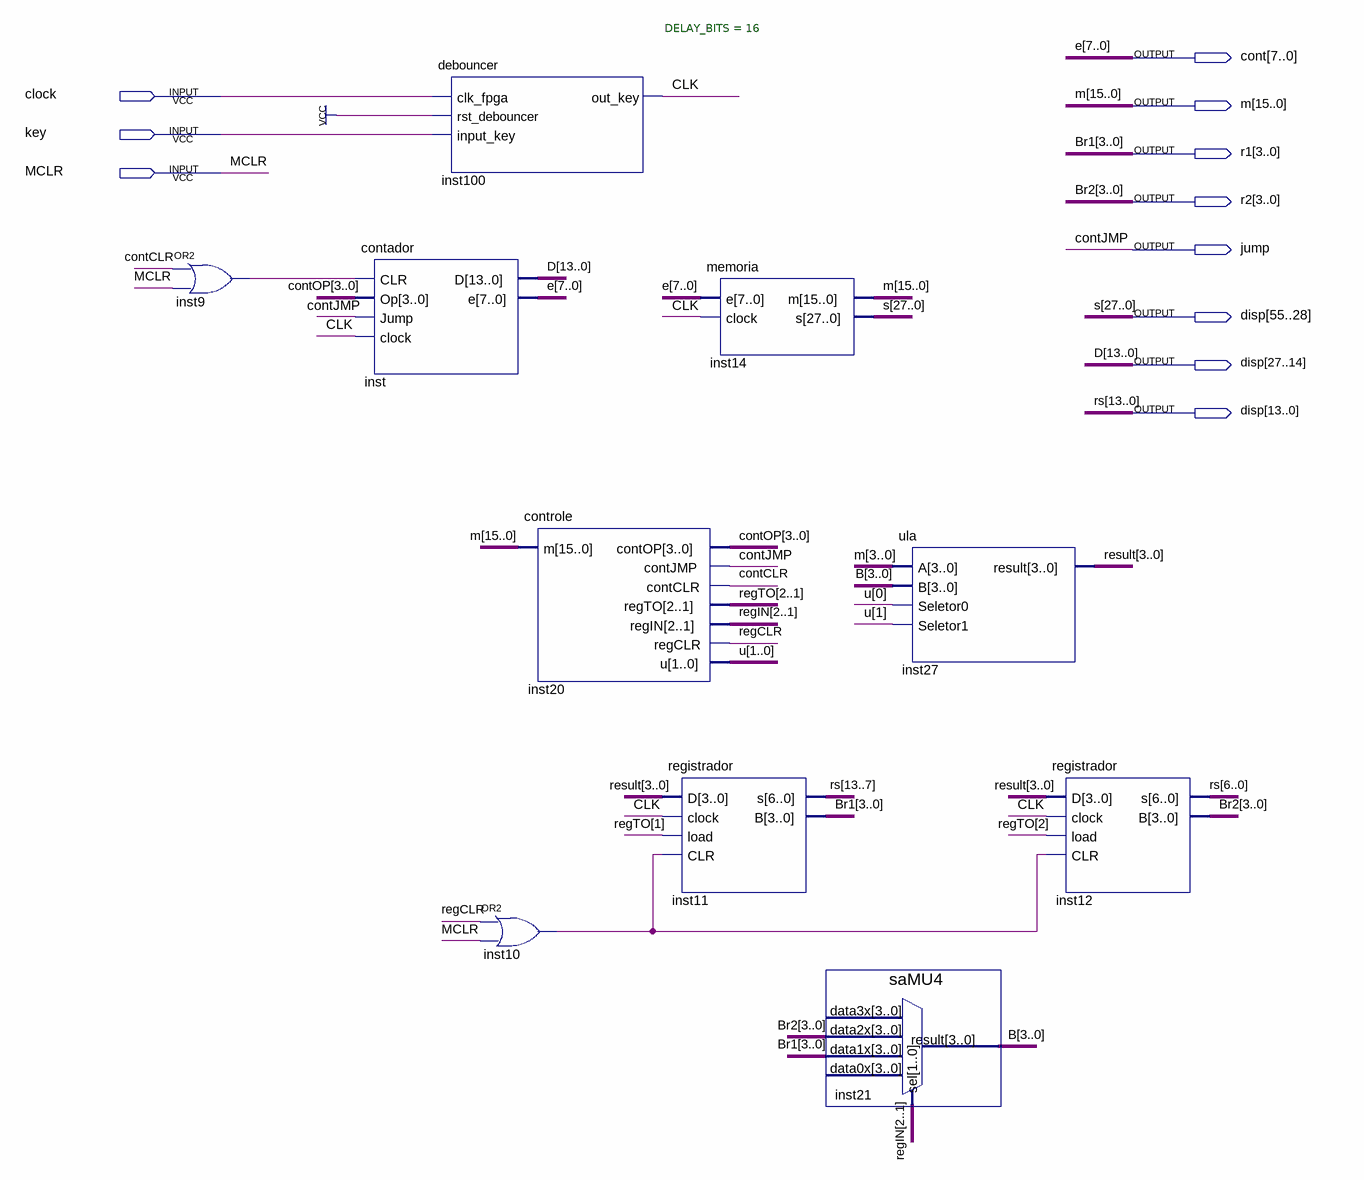
[diagram p0: schematic sheet]
// Quartus schematic ProjetoCPU.bdf as structural Verilog: 10 symbols, 11 pins
module ProjetoCPU (
  input  clock,
  input  key,
  input  MCLR,
  output [7:0] cont,
  output [15:0] m,
  output [3:0] r1,
  output [3:0] r2,
  output jump,
  output [55:0] disp
);

  wire CLK, contCLR, inst9_out, inst10_out, regCLR;
  wire [1:0] u;
  wire [2:1] regIN, regTO;
  wire [3:0] B, contOP, result;

  or inst9 (inst9_out, contCLR, MCLR);
  contador inst (.CLR(inst9_out), .Op(contOP), .Jump(jump), .clock(CLK), .D(disp[27:14]), .e(cont));
  debouncer #(.DELAY_BITS(16)) inst100 (.clk_fpga(clock), .rst_debouncer(1'b1), .input_key(key), .out_key(CLK));
  controle inst20 (
    .m(m), .contOP(contOP), .contJMP(jump), .contCLR(contCLR), .regTO(regTO), .regIN(regIN), .regCLR(regCLR),
    .u(u));
  or inst10 (inst10_out, regCLR, MCLR);
  registrador inst11 (.D(result), .clock(CLK), .load(regTO[1]), .CLR(inst10_out), .s(disp[13:7]), .B(r1));
  memoria inst14 (.e(cont), .clock(CLK), .m(m), .s(disp[55:28]));
  saMU4 inst21 (.data2x(r2), .data1x(r1), .sel(regIN), .result(B));  // open: data3x, data0x
  ula inst27 (.A(m[3:0]), .B(B), .Seletor0(u[0]), .Seletor1(u[1]), .result(result));
  registrador inst12 (.D(result), .clock(CLK), .load(regTO[2]), .CLR(inst10_out), .s(disp[6:0]), .B(r2));

  // Other names for the same wires on the sheet: Br1[3:0] = r1; Br2[3:0] = r2; contJMP = jump; D[13:0] = disp[27:14];
  //   e[7:0] = cont; rs[13:0] = disp[13:0]; s[27:0] = disp[55:28]
endmodule
